# EAGLE design FGPMMOPA6x (EAGLE 6.3)
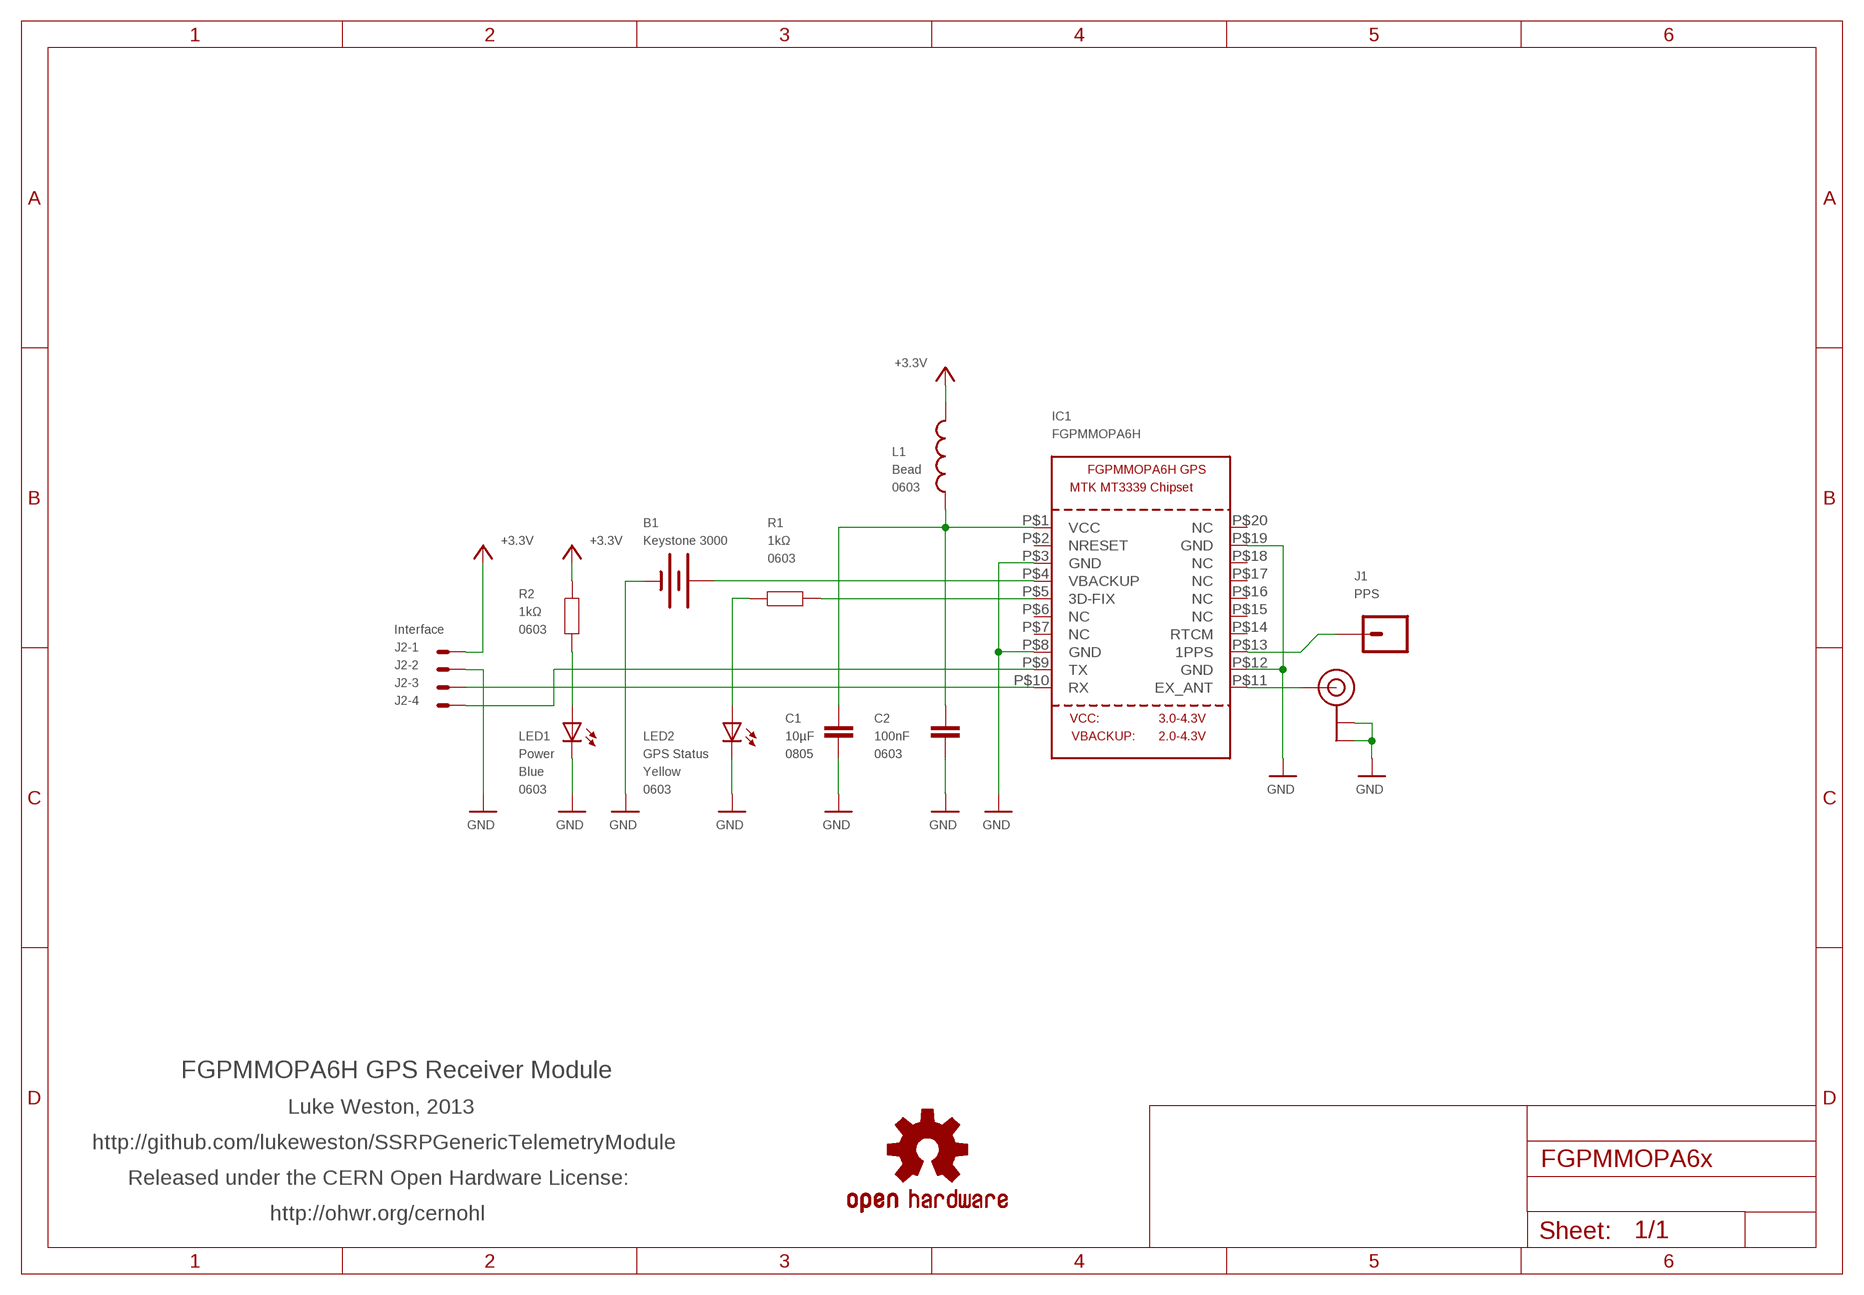
[diagram p0: schematic, sheet 1]

## Parts
B1  Keystone 3000  BATTERY12MM  [BATTCON_12MM]
C1  10µF  CAP0805  [0805]
C2  100nF  CAP0603  [0603]
IC1  FGPMMOPA6H  GPS_FGPMMOPA6H  [FGPMMOPA6H]
J1  PPS  M01PTH  [1X01]
J2  Interface  22-05-7048-04  [7395-04]
J3  U.FL  [U.FL]
L1  Bead  INDUCTOR0603  [0603]
LED1  Power  LED0603  [LED-0603]
LED2  GPS Status  LED0603  [LED-0603]
R1  1kΩ  RESISTOR0603  [0603]
R2  1kΩ  RESISTOR0603  [0603]
SY2  OSHW-LOGOS  [OSHW-LOGO-S]

## Nets
+3V3: J2.1 L1.2 R2.2 ; supply symbol labelled +3.3V
GND: B1.GND(-) C1.1 C2.1 IC1.P$3(GND) IC1.P$8(GND) IC1.P$12(GND) IC1.P$19(GND) J2.2 J3.P$1(GND) J3.P$2(GND) LED1.C LED2.C
N$8: C1.2 C2.2 IC1.P$1(VCC) L1.1
N$10: B1.PWR@1(+) IC1.P$4(VBACKUP)
N$13: IC1.P$5(3D-FIX) R1.2
N$14: IC1.P$9(TX) J2.4
N$15: IC1.P$10(RX) J2.3
N$16: IC1.P$13(1PPS) J1.1
N$17: IC1.P$11(EX_ANT) J3.P$3(SIGNAL)
N$19: LED2.A R1.1
N$20: LED1.A R2.1
Unconnected: IC1.P$2(NRESET) IC1.P$6(NC) IC1.P$7(NC) IC1.P$14(RTCM) IC1.P$15(NC) IC1.P$16(NC) IC1.P$17(NC) IC1.P$18(NC) IC1.P$20(NC)

## Notes on the sheet
- FGPMMOPA6H GPS Receiver Module
- Luke Weston, 2013
- http://github.com/lukeweston/SSRPGenericTelemetryModule
- Released under the CERN Open Hardware License:
- http://ohwr.org/cernohl

## Library data of the parts
B1 = SparkFun:BATTERY: Battery Holders Various common sizes : AA, AAA, 20mm coin cell and 12mm coin cell.
C1 = freetronics-master-v1:CAP: Capacitor Standard 0603 ceramic capacitor, and 0.1" leaded capacitor.; PACKAGE: 0805
C2 = freetronics-master-v1:CAP: Capacitor Standard 0603 ceramic capacitor, and 0.1" leaded capacitor.; PACKAGE: 0603
IC1 = microbuilder:GPS_FGPMMOPA6H: GPS Module - MTK MT3339 Chipset, -165dBm sensitivity, 22 channels, 10Hz, auto-select external antenna options
J1 = freetronics-master-v1:M01: Header 1 Standard 1-pin 0.1" header. Use with straight break away headers (SKU : PRT-00116), right angle break away headers (PRT-00553), swiss pins (PRT-00743), machine pins (PRT-00117), and female headers (PRT-00115).
J2 = con-molex:22-?-04: CONNECTOR wire to board 2.54 mm (.1 inch) pitch header; OC_FARNELL: unknown; OC_NEWARK: unknown
J3 = microbuilder:U.FL: U.FL Antenna Connector
L1 = freetronics-master-v1:INDUCTOR: Inductors Basic Inductor/Choke - 0603 and 1206. Footprints are not proven and vary greatly between part numbers.; PACKAGE: 0603
LED1 = freetronics-master-v1:LED: LEDs Standard schematic elements and footprints for 5mm, 3mm, 1206, and 0603 sized LEDs. 5mm - Spark Fun Electronics SKU : COM-00529 (and others); COLOUR: Blue; PACKAGE: 0603
LED2 = freetronics-master-v1:LED: LEDs Standard schematic elements and footprints for 5mm, 3mm, 1206, and 0603 sized LEDs. 5mm - Spark Fun Electronics SKU : COM-00529 (and others); COLOUR: Yellow; PACKAGE: 0603
R1 R2 = freetronics-master-v1:RESISTOR: Resistor Basic schematic elements and footprints for 0603, 1206, and PTH 1/10th watt (small) resistors.; PACKAGE: 0603
SY2 = SparkFun:OSHW-LOGO: Open Source Hardware Logo This logo indicates the piece of hardware it is found on incorporates a OSHW license and/or adheres to the definition of open source hardware found here: http://freedomdefined.org/OSHW

## Board
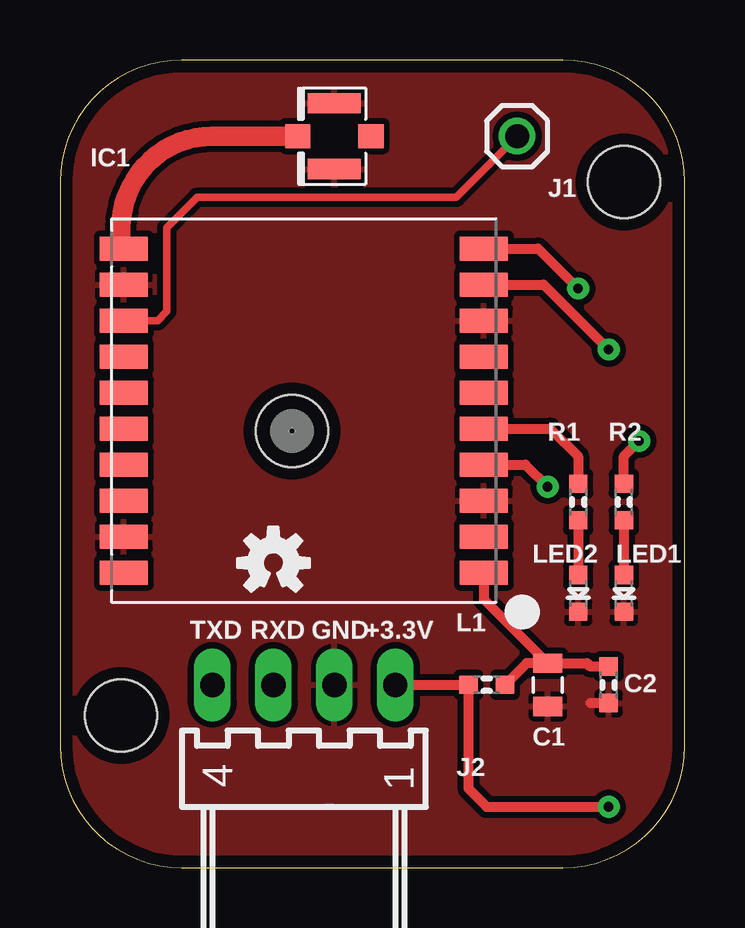
[diagram p1: board, top side]
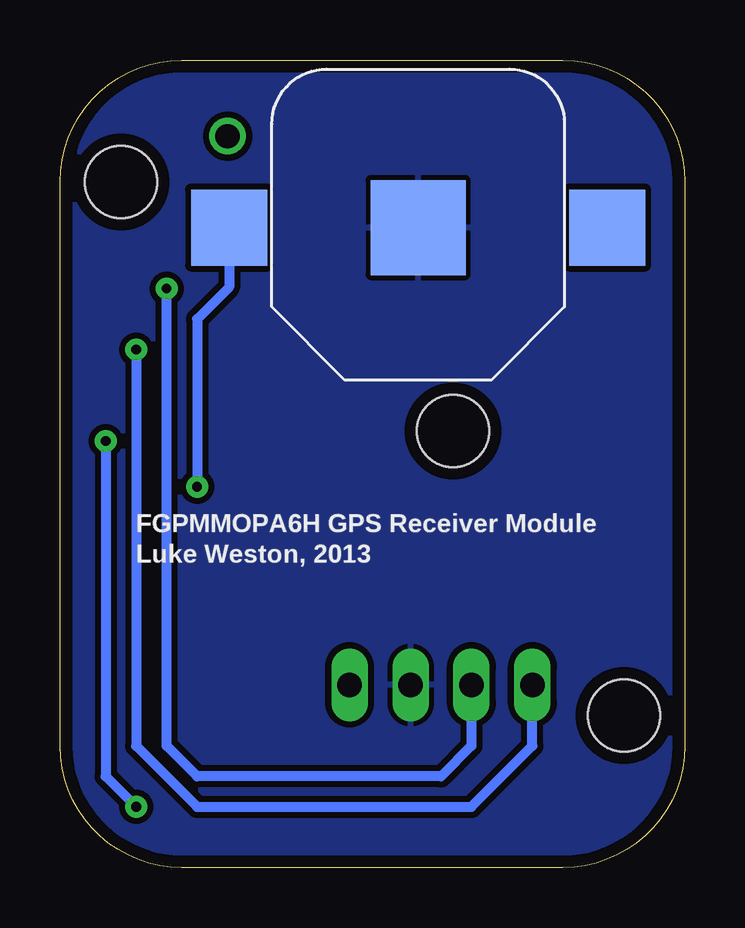
[diagram p2: board, bottom side, seen from below]

Size 26.04 x 33.65 mm. Coordinates in mm from the lower left corner, seen from the top.
Outline: 20.96,33.65 5.08,33.65 arc90 0,28.57 0,5.08 arc90 5.08,0 20.96,0 arc90 26.04,5.08 26.04,28.57 arc90 20.96,33.65
Copper layers (1*16): Top 0.035mm / dielectric 1.5mm / Bottom 0.035mm
Design rules "PCBCart-Standard *": minimum track width 8mil, minimum drill 0.4mm, track to track 8mil, track to pad 8mil, pad to pad 8mil, via to via 8mil, smd to smd 8mil, copper to edge 20mil, drill to drill 8mil, minimum pad ring 8mil, minimum via ring 10mil, stop-mask expansion 3mil, vias tented up to drill 16mil, thermal gap 8mil
Holes 3 mm at 2.54,6.35 23.5,28.57

### Footprints (pad centres in the part's own frame; a part is rotated, then mirrored left to right if it is on the bottom)
BATTCON_12MM = smd 3.962 x 3.962: GND 0,0 | smd 3.175 x 3.175: PWR@1 -7.874,0; PWR@2 7.874,0
0805 = smd 0.8 x 1.2: 1 -0.9,0; 2 0.9,0
0603 = smd 0.762 x 0.762: 1 -0.762,0; 2 0.762,0
FGPMMOPA6H = smd 2 x 1: P$1 -7.5,6.75; P$2 -7.5,5.25; P$3 -7.5,3.75; P$4 -7.5,2.25; P$5 -7.5,0.75; P$6 -7.5,-0.75; P$7 -7.5,-2.25; P$8 -7.5,-3.75; P$9 -7.5,-5.25; P$10 -7.5,-6.75; P$11 7.5,-6.75; P$12 7.5,-5.25; P$13 7.5,-3.75; P$14 7.5,-2.25; P$15 7.5,-0.75; P$16 7.5,0.75; P$17 7.5,2.25; P$18 7.5,3.75; P$19 7.5,5.25; P$20 7.5,6.75 | hole 3: 0.5,0.85
1X01 = drill 1.016: 1 0,0
7395-04 = drill 1.016 long: 1 3.81,0; 2 1.27,0; 3 -1.27,0; 4 -3.81,0
U.FL = smd 2.2 x 0.85: P$1 0,1.375; P$2 0,-1.375 | smd 1.05 x 1: P$3 1.525,0; P$4 -1.525,0
LED-0603 = smd 0.762 x 0.762: A -0.762,0; C 0.762,0

### Placement (x,y rotation side)
B1  11.11,26.67 0 bottom
C1  20.32,7.62 90 top
C2  22.86,7.62 90 top
IC1  10.16,19.05 180 top
J1  19.05,30.48 0 top
J2  10.16,7.62 0 top
J3  11.43,30.48 180 top
L1  17.78,7.62 180 top
LED1  23.5,11.43 270 top
LED2  21.59,11.43 270 top
R1  21.59,15.24 90 top
R2  23.5,15.24 90 top
SY2  8.89,12.7 0 top

### Tracks (layer width: path | path; a pad name or v marks a point on that pad's centre or on a via)
+3V3  (via drill 0.4)
  Top 0.406: J2.1 L1.2 17.02,3.3 17.78,2.54 v22.86,2.54 | R2.2 23.5,17.14 v24.13,17.78
  Bottom 0.406: v24.13,17.78 24.13,3.81 v22.86,2.54
GND
  Top 0.406: C2.1 22.1,6.86
  pour Bottom (isolate 0.254): -1.27,35.56 27.94,35.56 27.94,-1.27 -1.27,-1.27
  pour Top (isolate 0.254): -1.27,35.56 27.94,35.56 27.94,-1.27 -1.27,-1.27
N$8
  Top 0.406: C1.2 19.44,8.52 L1.1 | C2.2 22.1,8.38 21.96,8.52 C1.2 | IC1.P$1 17.66,11.18 C1.2
N$10  (via drill 0.4)
  Top 0.406: IC1.P$4 19.39,16.8 v20.32,15.88
  Bottom 0.406: B1.PWR@1 18.99,24.19 20.32,22.86 v20.32,15.88
N$13
  Top 0.406: IC1.P$5 20.43,18.3 21.59,17.14 R1.2
N$14  (via drill 0.4)
  Top 0.406: IC1.P$9 20.15,24.3 v22.86,21.59
  Bottom 0.406: v22.86,21.59 22.86,5.08 20.32,2.54 8.89,2.54 6.35,5.08 J2.4
N$15  (via drill 0.4)
  Top 0.406: IC1.P$10 19.92,25.8 v21.59,24.13
  Bottom 0.406: J2.3 8.89,5.08 10.16,3.81 20.32,3.81 21.59,5.08 v21.59,24.13
N$16
  Top 0.305: IC1.P$13 4.07,22.8 4.45,23.18 4.45,26.67 5.71,27.94 16.51,27.94 J1.1
N$17
  Top 0.406: IC1.P$11 arc-90 2.54,25.92
  Top 0.813: 2.54,25.92 2.54,26.67 arc-90 6.35,30.48 J3.P$3
N$19
  Top 0.406: R1.1 LED2.A
N$20
  Top 0.406: R2.1 LED1.A

### Text on the board
tPlace: TXD | RXD | GND | +3.3V
bPlace: FGPMMOPA6H GPS Receiver Module | Luke Weston, 2013